# Altium schematic sheet MCX_Buffer.SchDoc: DIO MCX 16
size 420 x 297 mm; Author: G.Kasprowicz; CompanyName: WUT ISE; DrawnBy: G.Kasprowicz; Organization: WUT ISE; Address1: PW ISE; Address2: Nowowiejska 15/19 00-665 Warsaw; Address3: gkasprow@gmail.com; DocumentNumber: 5; SheetNumber: 5; SheetTotal: 7; ModifiedBy: -; CheckedDate: -; Title2: TTL buffers; DivGrp: WUT ISE; Designer: G.Kasprowicz; ModifiedDate: -; ProjectName: Sensor Box
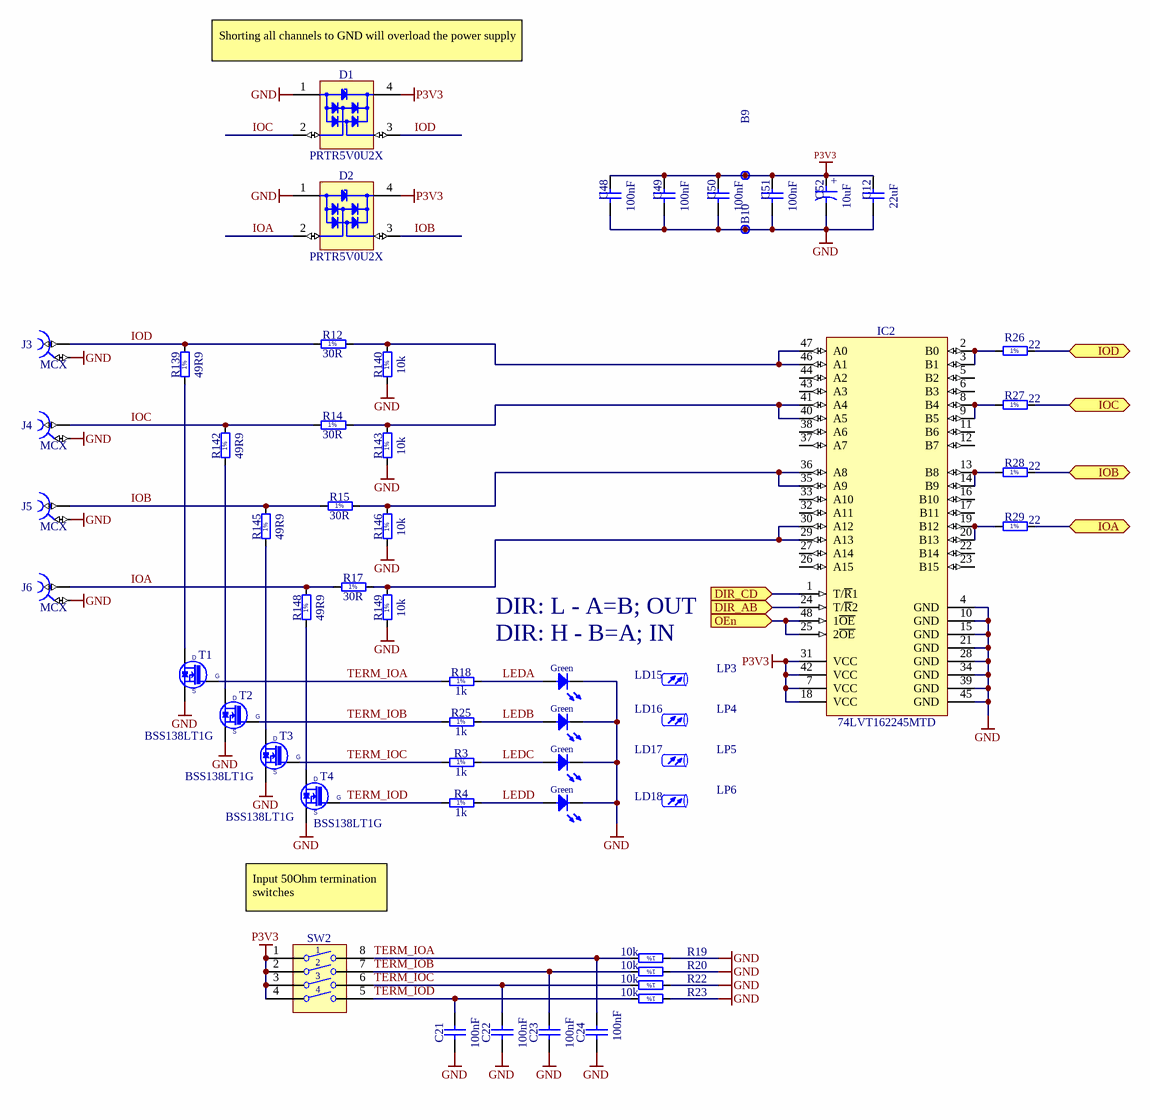
[diagram p0: MCX_Buffer.SchDoc]

## Parts
B9  Plated Hole  [c130h60]  (value not drawn)
B10  Plated Hole  [c130h60]  (value not drawn)
C12  22uF  [CAPC2012X135N]
C21  100nF  [CAPC1005X55N]
C22  100nF  [CAPC1005X55N]
C23  100nF  [CAPC1005X55N]
C24  100nF  [CAPC1005X55N]
C48  100nF  [CAPC1005X55N]
C49  100nF  [CAPC1005X55N]
C50  100nF  [CAPC1005X55N]
C51  100nF  [CAPC1005X55N]
C52  10uF  [CAPAE430X540N]
D1  PRTR5V0U2X  [SOT190P230X110-4N]
D2  PRTR5V0U2X  [SOT190P230X110-4N]
IC2  74LVT162245MTD  [SOP50P810X120-48N]
J3  MCX  [Belfuse_133-3701-801]
J4  MCX  [Belfuse_133-3701-801]
J5  MCX  [Belfuse_133-3701-801]
J6  MCX  [Belfuse_133-3701-801]
LD15  Green  [LED_AVAGO_HSME-C120]  (value not drawn)
LD16  Green  [LED_AVAGO_HSME-C120]  (value not drawn)
LD17  Green  [LED_AVAGO_HSME-C120]  (value not drawn)
LD18  Green  [LED_AVAGO_HSME-C120]  (value not drawn)
LP3  (no value)  [FIX&FASTEN-LEMB2-8V0-F]
LP4  (no value)  [FIX&FASTEN-LEMB2-8V0-F]
LP5  (no value)  [FIX&FASTEN-LEMB2-8V0-F]
LP6  (no value)  [FIX&FASTEN-LEMB2-8V0-F]
R3  1k  [RESC1005X40N]
R4  1k  [RESC1005X40N]
R12  30R  [RESC3225X70N]
R14  30R  [RESC3225X70N]
R15  30R  [RESC3225X70N]
R17  30R  [RESC3225X70N]
R18  1k  [RESC1005X40N]
R19  10k  [RESC1005X40N]
R20  10k  [RESC1005X40N]
R22  10k  [RESC1005X40N]
R23  10k  [RESC1005X40N]
R25  1k  [RESC1005X40N]
R26  22  [RESC1005X40N]
R27  22  [RESC1005X40N]
R28  22  [RESC1005X40N]
R29  22  [RESC1005X40N]
R139  49R9  [RESC3225X70N]
R140  10k  [RESC1005X40N]
R142  49R9  [RESC3225X70N]
R143  10k  [RESC1005X40N]
R145  49R9  [RESC3225X70N]
R146  10k  [RESC1005X40N]
R148  49R9  [RESC3225X70N]
R149  10k  [RESC1005X40N]
SW2  Switch  [SW_OMRON_A6S-4102-H]  (value not drawn)
T1  BSS138LT1G  [SOT95P240X110-3N]
T2  BSS138LT1G  [SOT95P240X110-3N]
T3  BSS138LT1G  [SOT95P240X110-3N]
T4  BSS138LT1G  [SOT95P240X110-3N]

## Ports
DIR_AB (in), DIR_CD (in), IOA (bidir), IOB (bidir), IOC (bidir), IOD (bidir), OEn (in)

## Nets
GND: B10.1 C12.1 C21.1 C22.1 C23.1 C24.1 C48.1 C49.1 C50.1 C51.1 C52.2 D1.1(GND) D2.1(GND) IC2.4(GND) IC2.10(GND) IC2.15(GND) IC2.21(GND) IC2.28(GND) IC2.34(GND) IC2.39(GND) IC2.45(GND) J3.2 J4.2 J5.2 J6.2 LD15.1(C) LD16.1(C) LD17.1(C) LD18.1(C) R19.1 R20.1 R22.1 R23.1 R140.1 R143.1 R146.1 R149.1 T1.2(S) T2.2(S) T3.2(S) T4.2(S)
P3V3: B9.1 C12.2 C48.2 C49.2 C50.2 C51.2 C52.1 D1.4(VCC) D2.4(VCC) IC2.7(VCC) IC2.18(VCC) IC2.31(VCC) IC2.42(VCC) SW2.1 SW2.2 SW2.3 SW2.4
DIR_AB: IC2.24(T/~{R}2) ; port DIR_AB
DIR_CD: IC2.1(T/~{R}1) ; port DIR_CD
IOA: D2.2(I/O1) J6.1 R17.1 R148.2
IOA: R29.2 ; port IOA  [a separate net that carries the same name]
IOB: D2.3(I/O2) J5.1 R15.1 R145.2
IOB: R28.2 ; port IOB  [a separate net that carries the same name]
IOC: D1.2(I/O1) J4.1 R14.1 R142.2
IOC: R27.2 ; port IOC  [a separate net that carries the same name]
IOD: D1.3(I/O2) J3.1 R12.1 R139.2
IOD: R26.2 ; port IOD  [a separate net that carries the same name]
LEDA: LD15.2(A) R18.2
LEDB: LD16.2(A) R25.2
LEDC: LD17.2(A) R3.2
LEDD: LD18.2(A) R4.2
OEn: IC2.25(2~{OE}) IC2.48(1~{OE}) ; port OEn
TERM_IOA: C24.2 R18.1 R19.2 SW2.8 T1.1(G)
TERM_IOB: C23.2 R20.2 R25.1 SW2.7 T2.1(G)
TERM_IOC: C22.2 R3.1 R22.2 SW2.6 T3.1(G)
TERM_IOD: C21.2 R4.1 R23.2 SW2.5 T4.1(G)
NetIC2_2: IC2.2(B0) IC2.3(B1) R26.1
NetIC2_8: IC2.8(B4) IC2.9(B5) R27.1
NetIC2_13: IC2.13(B8) IC2.14(B9) R28.1
NetIC2_19: IC2.19(B12) IC2.20(B13) R29.1
NetIC2_29: IC2.29(A13) IC2.30(A12) R17.2 R149.2
NetIC2_35: IC2.35(A9) IC2.36(A8) R15.2 R146.2
NetIC2_40: IC2.40(A5) IC2.41(A4) R14.2 R143.2
NetIC2_46: IC2.46(A1) IC2.47(A0) R12.2 R140.2
NetR139_1: R139.1 T1.3(D)
NetR142_1: R142.1 T2.3(D)
NetR145_1: R145.1 T3.3(D)
NetR148_1: R148.1 T4.3(D)

Not connected (* = marked no-connect by the designer): IC2 5(B2) 6(B3) 11(B6) 12(B7) 16(B10) 17(B11) 22(B14) 23(B15) 26(A15) 27(A14) 32(A11) 33(A10) 37(A7) 38(A6) 43(A3) 44(A2)

## Notes on the sheet
- (near D1) Shorting all channels to GND will overload the power supply
- DIR: L - A=B; OUT
- DIR: H - B=A; IN
- Input 50Ohm termination switches
- Project/Equipment
- Document
- Designer
- Drawn by
- Check.by
- Copyright WUT ISE 2018.
  This documentation describes Open Hardware and is licensed under the CERN OHL v.1.1. You may redistribute and modify this documentation under the terms of the CERN OHL v.1.1. (http://ohwr.org/CERNOHL). This documentation is distributed WITHOUT ANY EXPRESS OR IMPLIED WARRANTY, INCLUDING OF MERCHANTABILITY, SATISFACTORY QUALITY AND FITNESS FOR A PARTICULAR PURPOSE. Please see the CERN OHL v.1.1 for applicable conditions.
- Contact
- File
- Last Mod.
- Print Date
- Sheet
- Size
- A3
- of
- Rev
- (in symbol CAE430-540_10UF_16V_20%) +
- (in symbol R0402_1K_1%_0.0625W_100PPM) 1%
- (in symbol R0402_10K_1%_0.0625W_100PPM) 1%
- (in symbol R0402_22R_1%_0.0625W_100PPM) 1%
- (in symbol R1210_30R_5%_0.5W_200PPM) 1%
- (in symbol R1210_49R9_1%_0.5W_100PPM_VISHAY_CRCW) 1%

## Library data of the parts
B9 B10 = PLATED_HOLE0.6_PAD1.3: Single Terminal Socket; Part Description: Plated Through Hole: Hole Dia.=0.6mm Pad Dia.=1.3mm; Mounted: No; Part Number: PLATED_HOLE0.6_PAD1.3; Component Kind: Standard (No BOM); Component Type: Standard (No BOM); Pin Count: 1; Family: Plated Hole; Socket: No; SMD: No; Sense: No; Status: None; ComponentHeight: 0mm; HelpURL: Undefined; Author: CERN DEM MR; CreateDate: 02.03.2016; LatestRevisionDate: 02.03.2016; PackageDescription: Plated Through Hole: Hole Dia.=0.6mm Pad Dia.=1.3mm
C12 = CC0805_22UF_16V_10%_X5R: Non-polarised capacitor; Part Description: SMD Multilayer Chip Ceramic Capacitor; Manufacturer: GENERIC; Manufacturer1 Part Number: C2012X5R1C226KT; Voltage: 16V; TC: X5R; Tolerance: ±10%; Part Number: CC0805_22UF_16V_10%_X5R; Component Kind: Standard; Component Type: Standard; Pin Count: 2; Value: 22uF; Status: Preferred; Manufacturer Part Number: CC0805_22UF_16V_10%_X5R; Case: 0805; Mounted: Yes; Socket: No; SMD: Yes; Sense: No; Manufacturer1 Example: TDK; Manufacturer1 ComponentHeight: 1.35mm; HelpURL: \\cern.ch\dfs\Applications\Altium\Datasheets\CC0805_X5R_TDK_C.pdf; Author: CERN DEM JLC; CreateDate: 25.10.2012; LatestRevisionDate: 25.10.2012
C21-C24 C48-C51 = CC0402_100NF_16V_10%_X5R: Non-polarised capacitor; Part Description: SMD Multilayer Chip Ceramic Capacitor; Manufacturer: GENERIC; Manufacturer1 Part Number: GRM155R61C104KA88D; Voltage: 16V; TC: X5R; Tolerance: ±10%; Part Number: CC0402_100NF_16V_10%_X5R; Component Kind: Standard; Component Type: Standard; Pin Count: 2; Value: 100nF; Status: None; Manufacturer Part Number: CC0402_100NF_16V_10%_X5R; Case: 0402; Mounted: Yes; Socket: No; SMD: Yes; Sense: No; Manufacturer1 Example: MURATA; Manufacturer1 ComponentHeight: 0.55mm; HelpURL: \\cern.ch\dfs\Applications\Altium\Datasheets\CC0402_X5R_MURATA_GRM.pdf; Author: CERN DEM JLC; CreateDate: 10.12.2013; LatestRevisionDate: 10.12.2013
C52 = CAE430-540_10UF_16V_20%: Polarised capacitor; Part Description: Aluminum Electrolytic SMT Capacitor; Manufacturer: PANASONIC; Manufacturer Part Number: EEEFK1C100AR; Voltage: 16V; Tolerance: ±20%; Part Number: CAE430-540_10UF_16V_20%; Component Kind: Standard; Component Type: Standard; Pin Count: 2; Value: 10uF; Status: Not Recommended; Case: B; Mounted: Yes; Socket: No; SMD: Yes; Sense: No; ComponentHeight: 5.8mm; HelpURL: \\cern.ch\dfs\Applications\Altium\Datasheets\CAE_PANASONIC_FK.pdf; Author: CERN DEM JLC; CreateDate: 03.12.2007; LatestRevisionDate: 05.11.2014
D1 D2 = PRTR5V0U2X: Ultra Low Capacitance Double Rail-to-Rail ESD Protection Diode; Part Description: Ultra Low Capacitance (1pF) Double Rail-to-Rail ESD Protection Diode (8kV); Manufacturer: NXP SEMICONDUCTORS; Voltage: 5.5V; PressFit: No; Bonding: No; Part Number: PRTR5V0U2X; Component Kind: Standard; Component Type: Standard; Device: PRTR5V0U2X; PackageDescription: SOT143B, SOT, 1.90mm Pitch; 4 Pin, 1.30mm W X 2.90mm L X 1.10mm H body, IPC Medium Density; Manufacturer Part Number: PRTR5V0U2X; Pin Count: 4; Case: SOT143B; Mounted: Yes; Socket: No; SMD: Yes; Sense: No; ComponentHeight: 1.1mm; HelpURL: \\cern.ch\dfs\Applications\Altium\Datasheets\PRTR5V0U2X.pdf; Author: CERN DEM JLC; CreateDate: 22.03.2011; LatestRevisionDate: 22.03.2011
IC2 = 74LVT162245MTD: Low Voltage 16-Bit Transceiver with 3-STATE Outputs and 25 Ohm Series Resistors in A Port Outputs; Manufacturer: FAIRCHILD SEMICONDUCTOR; PressFit: No; Bonding: No; Part Number: 74LVT162245MTD; Component Kind: Standard; Component Type: Standard; Device: 74LVT162245MTD; PackageDescription: SOP, 48-Leads, Body 12.6x6.2mm (max), Pitch 0.50mm, IPC Medium Density; Part Description: Low Voltage 16-Bit Transceiver with 3-STATE Outputs and 25 Ohm Series Resistors in A Port Outputs; Manufacturer Part Number: 74LVT162245MTD; Pin Count: 48; Case: TSSOP48; Mounted: Yes; Socket: No; SMD: Yes; Sense: No; ComponentHeight: 1.2mm; Author: CERN DEM MR; HelpURL: \\cern.ch\dfs\Applications\Altium\Datasheets\74LVT162245MTD.pdf; CreateDate: 06.12.2016; LatestRevisionDate: 06.12.2016
J3-J6 = CON_MCX_133-3701-801: MCX 50 OhmEnd Launch Jack Receptacle -Round C ontact; Part Number: Belfuse_133-3701-806; Part Description: 50 Ohm, RF Connector, MCX Right Angle PCB Receptacle Jack; Manufacturer: Belfuse/Cinch; Manufacturer Part Number: 133-3701-806; PressFit: No; Component Kind: Standard; Component Type: Standard; Footprint: Belfuse_133-3701-806; Pin Count: 5; Family: MCX; Mounted: Yes; Socket: No; SMD: Yes; Sense: No; Status: None; ComponentHeight: 6mm; HelpURL: \\cern.ch\dfs\Applications\Altium\Datasheets\AMPHENOL_919-383J-51A.pdf; Author: GK; CreateDate: 31.01.2019; LatestRevisionDate: 31.01.2019
LD15-LD18 = LED_AVAGO_HSME-C120: LED Green 1C 2A; Part Description: High Performance Right Angle Chip Green LED; Manufacturer: AVAGO TECHNOLOGIES; PressFit: No; Bonding: No; Part Number: LED_AVAGO_HSME-C120; Component Kind: Standard; Component Type: Standard; Color: Green; PackageDescription: Green Chip LED, 2-Leads, Body 1.7x1.1mm, Side Emitting Package; Manufacturer Part Number: HSME-C120; Pin Count: 2; Mounted: Yes; Socket: No; SMD: Yes; Sense: No; ComponentHeight: 0.7mm; HelpURL: \\cern.ch\dfs\Applications\Altium\Datasheets\LED_AVAGO_HSME-C120.pdf; ComponentLink1URL: \\cern.ch\dfs\Applications\Altium\Datasheets\LED_AVAGO_HSME-C110_DESIGN-GUIDE.pdf; ComponentLink1Description: Design Guide; Author: CERN DEM JMW; CreateDate: 22.07.2009; LatestRevisionDate: 20.06.2012
LP3-LP6 = LED Light_pipe_2.3x8mm: Part Description: Right Angle Single Element 2.3x8mm Round Lightpipe; Manufacturer: FIX&FASTEN; Manufacturer Part Number: FIX-LEMB2-8V0-F; PressFit: No; Bonding: No; Part Number: FIX&FASTEN-LEMB2-8V0-F; Component Kind: Accessories; Component Type: Standard; PackageDescription: Right Angle Single Element 2.3mmx8mm Round Lightpipe; Pin Count: 0; Mounted: Yes; Socket: No; SMD: No; Sense: No; ComponentHeight: 2.3mm; HelpURL: \\cern.ch\dfs\Applications\Altium\Datasheets\LEDLP_DIALIGHT_515-1049F.pdf; Author: GK; CreateDate: 24.01.2017; LatestRevisionDate: 24.01.2017
R3 R4 R18 R25 = R0402_1K_1%_0.0625W_100PPM: Resistor - 1%; Part Description: General Purpose Thick Film Chip Resistor; Manufacturer: GENERIC; Manufacturer1 Part Number: 232270671002L; TC: ±100ppm/°C; PressFit: No; Part Number: R0402_1K_1%_0.0625W_100PPM; Component Kind: Standard; Component Type: Standard; Pin Count: 2; Value: 1k; Status: Not Recommended; Power: 0.0625W; Tolerance: ±1%; Manufacturer Part Number: R0402_1K_1%_0.0625W_100PPM; Case: 0402; Mounted: Yes; Sense: No; Socket: No; SMD: Yes; Manufacturer1 Example: YAGEO PHYCOMP; Manufacturer1 ComponentHeight: 0.4mm; HelpURL: \\cern.ch\dfs\Applications\Altium\Datasheets\R0402_Phycomp_RC0402.pdf; Author: CERN DEM JLC; CreateDate: 03.12.2007; LatestRevisionDate: 17.10.2012
R12 R14 R15 R17 = R1210_30R_5%_0.5W_200PPM: Resistor - 5%; Part Description: Thick Film Chip Resistor; Manufacturer: VISHAY; Manufacturer Part Number: CRCW121030R0JNEA; Power: 0.5W; TC: ±200ppm/°C; PressFit: No; Part Number: R1210_30R_5%_0.5W_200ppm; Component Kind: Standard; Component Type: Standard; Pin Count: 2; Value: 30R; Status: None; Tolerance: ±5%; Case: 1210; Mounted: Yes; Sense: No; Socket: No; SMD: Yes; HelpURL: \\cern.ch\dfs\Applications\Altium\Datasheets\R1210_VISHAY_CRCW1210.pdf; Author: CERN DEM JMW; CreateDate: 06.08.2014; LatestRevisionDate: 06.08.2014; ComponentHeight: 0.6mm
R19 R20 R22 R23 R140 R143 R146 R149 = R0402_10K_1%_0.0625W_100PPM: Resistor - 1%; Part Description: General Purpose Thick Film Chip Resistor; Manufacturer: GENERIC; Manufacturer1 Part Number: 232270671003L; TC: ±100ppm/°C; Part Number: R0402_10K_1%_0.0625W_100PPM; Component Kind: Standard; Component Type: Standard; Pin Count: 2; Value: 10k; Status: Not recommended; Power: 0.0625W; Tolerance: ±1%; Manufacturer Part Number: R0402_10K_1%_0.0625W_100PPM; Case: 0402; Mounted: Yes; Sense: No; Socket: No; SMD: Yes; Manufacturer1 Example: YAGEO PHYCOMP; Manufacturer1 ComponentHeight: 0.4mm; HelpURL: \\cern.ch\dfs\Applications\Altium\Datasheets\R0402_Phycomp_RC0402.pdf; Author: CERN DEM JLC; CreateDate: 03.12.2007; LatestRevisionDate: 17.10.2012
R26-R29 = R0402_22R_1%_0.0625W_100PPM: Resistor - 1%; Part Description: General Purpose Thick Film Chip Resistor; Manufacturer: GENERIC; Manufacturer1 Part Number: 232270672209L; TC: ±100ppm/°C; PressFit: No; Part Number: R0402_22R_1%_0.0625W_100PPM; Component Kind: Standard; Component Type: Standard; Pin Count: 2; Value: 22; Status: Not Recommended; Power: 0.0625W; Tolerance: ±1%; Manufacturer Part Number: R0402_22R_1%_0.0625W_100PPM; Case: 0402; Mounted: Yes; Sense: No; Socket: No; SMD: Yes; Manufacturer1 Example: YAGEO PHYCOMP; Manufacturer1 ComponentHeight: 0.4mm; HelpURL: \\cern.ch\dfs\Applications\Altium\Datasheets\R0402_Phycomp_RC0402.pdf; Author: CERN DEM JLC; CreateDate: 03.12.2007; LatestRevisionDate: 17.10.2012
R139 R142 R145 R148 = R1210_49R9_1%_0.5W_100PPM_VISHAY_CRCW: Resistor - 1%; Part Description: Thick Film Chip Resistor; Manufacturer: VISHAY DRALORIC; Manufacturer Part Number: CRCW121049R9FKTA; Power: 0.5W; TC: ±100ppm/°C; Part Number: R1210_49R9_1%_0.5W_100PPM_VISHAY_CRCW; Component Kind: Standard; Component Type: Standard; Pin Count: 2; Value: 49R9; Status: None; Tolerance: ±1%; Case: 1210; Mounted: Yes; Sense: No; Socket: No; SMD: Yes; ComponentHeight: 0.6mm; HelpURL: \\cern.ch\dfs\Applications\Altium\Datasheets\R1210_VISHAY_CRCW1210.pdf; Author: CERN DEM JMW; CreateDate: 06.08.2014; LatestRevisionDate: 06.08.2014
SW2 = SW_OMRON_A6S-4102-H: 4 Ways SPST DIP Switch; Part Description: 4 Ways SPST DIP Switch, White Flat Actuator with Seal Tape, Contact Rating 25mA 24VDC; Manufacturer: OMRON; PressFit: No; Part Number: SW_OMRON_A6S-4102-H; Component Kind: Standard; Component Type: Standard; Pin Count: 8; PackageDescription: Pitch 2.54mm, Body 11.3x6.4mm, 4 Ways SPST Surface-Mounting DIP Switch, OMRON A6S-H; Family: Switch; Mounted: Yes; Socket: No; SMD: Yes; Sense: No; Status: None; Manufacturer Part Number: A6S-4102-H; ComponentHeight: 3.8mm; HelpURL: \\cern.ch\dfs\Applications\Altium\Datasheets\SW_OMRON_A6S-4102-H.pdf; Author: CERN DEM JMW; CreateDate: 25.09.2008; LatestRevisionDate: 25.09.2008
T1-T4 = BSS138LT1G: N-CHANNEL MOSFET WITH DIODE; Part Description: 50V 200mA N-Channel Enhancement Mode Field-Effect Transistor; Manufacturer: ON SEMICONDUCTOR; PressFit: No; Bonding: No; Part Number: BSS138LT1G; Component Kind: Standard; Component Type: Standard; Device: BSS138LT1G; PackageDescription: SOT23 3-Leads, Pitch 0.95mm - Body 1.4x3mm, IPC Medium Density; Manufacturer Part Number: BSS138LT1G; Pin Count: 3; Case: SOT23-3; Mounted: Yes; Socket: No; SMD: Yes; Sense: No; ComponentHeight: 1.11mm; HelpURL: \\cern.ch\dfs\Applications\Altium\Datasheets\BSS138LT1G.pdf; Author: CERN DEM JLC; CreateDate: 23.03.2009; LatestRevisionDate: 23.03.2009